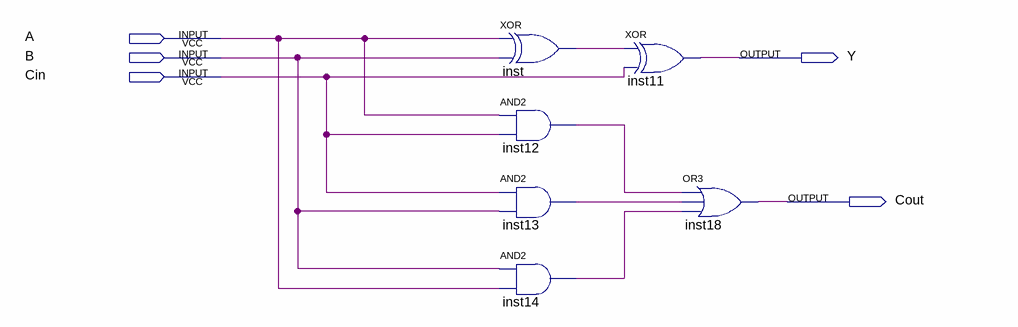
[diagram p0: schematic sheet]
// Quartus schematic add_1bit.bdf as structural Verilog: 6 symbols, 5 pins
module add_1bit (
  input  A,
  input  B,
  input  Cin,
  output Y,
  output Cout
);

  wire inst12_out, inst13_out, inst14_out, inst_out;

  xor inst (inst_out, A, B);
  and inst12 (inst12_out, A, Cin);
  and inst13 (inst13_out, Cin, B);
  and inst14 (inst14_out, B, A);
  xor inst11 (Y, inst_out, Cin);
  or inst18 (Cout, inst12_out, inst13_out, inst14_out);
endmodule
